# Altium schematic sheet 23_SFP_PORTS.SchDoc
size 419 x 296 mm; Author: Serbinov O.A.; CompanyName: ELSICOM; DrawnBy: Serbinov O.A.; Engineer: Serbinov O.A.; Organization: Elsicom; Address1: Kirova avenue, 58; Address2: Tomsk; Address3: Russia 634012; DocumentNumber: 24; SheetNumber: 24; SheetTotal: 44; ProjectName: 48_PORTS
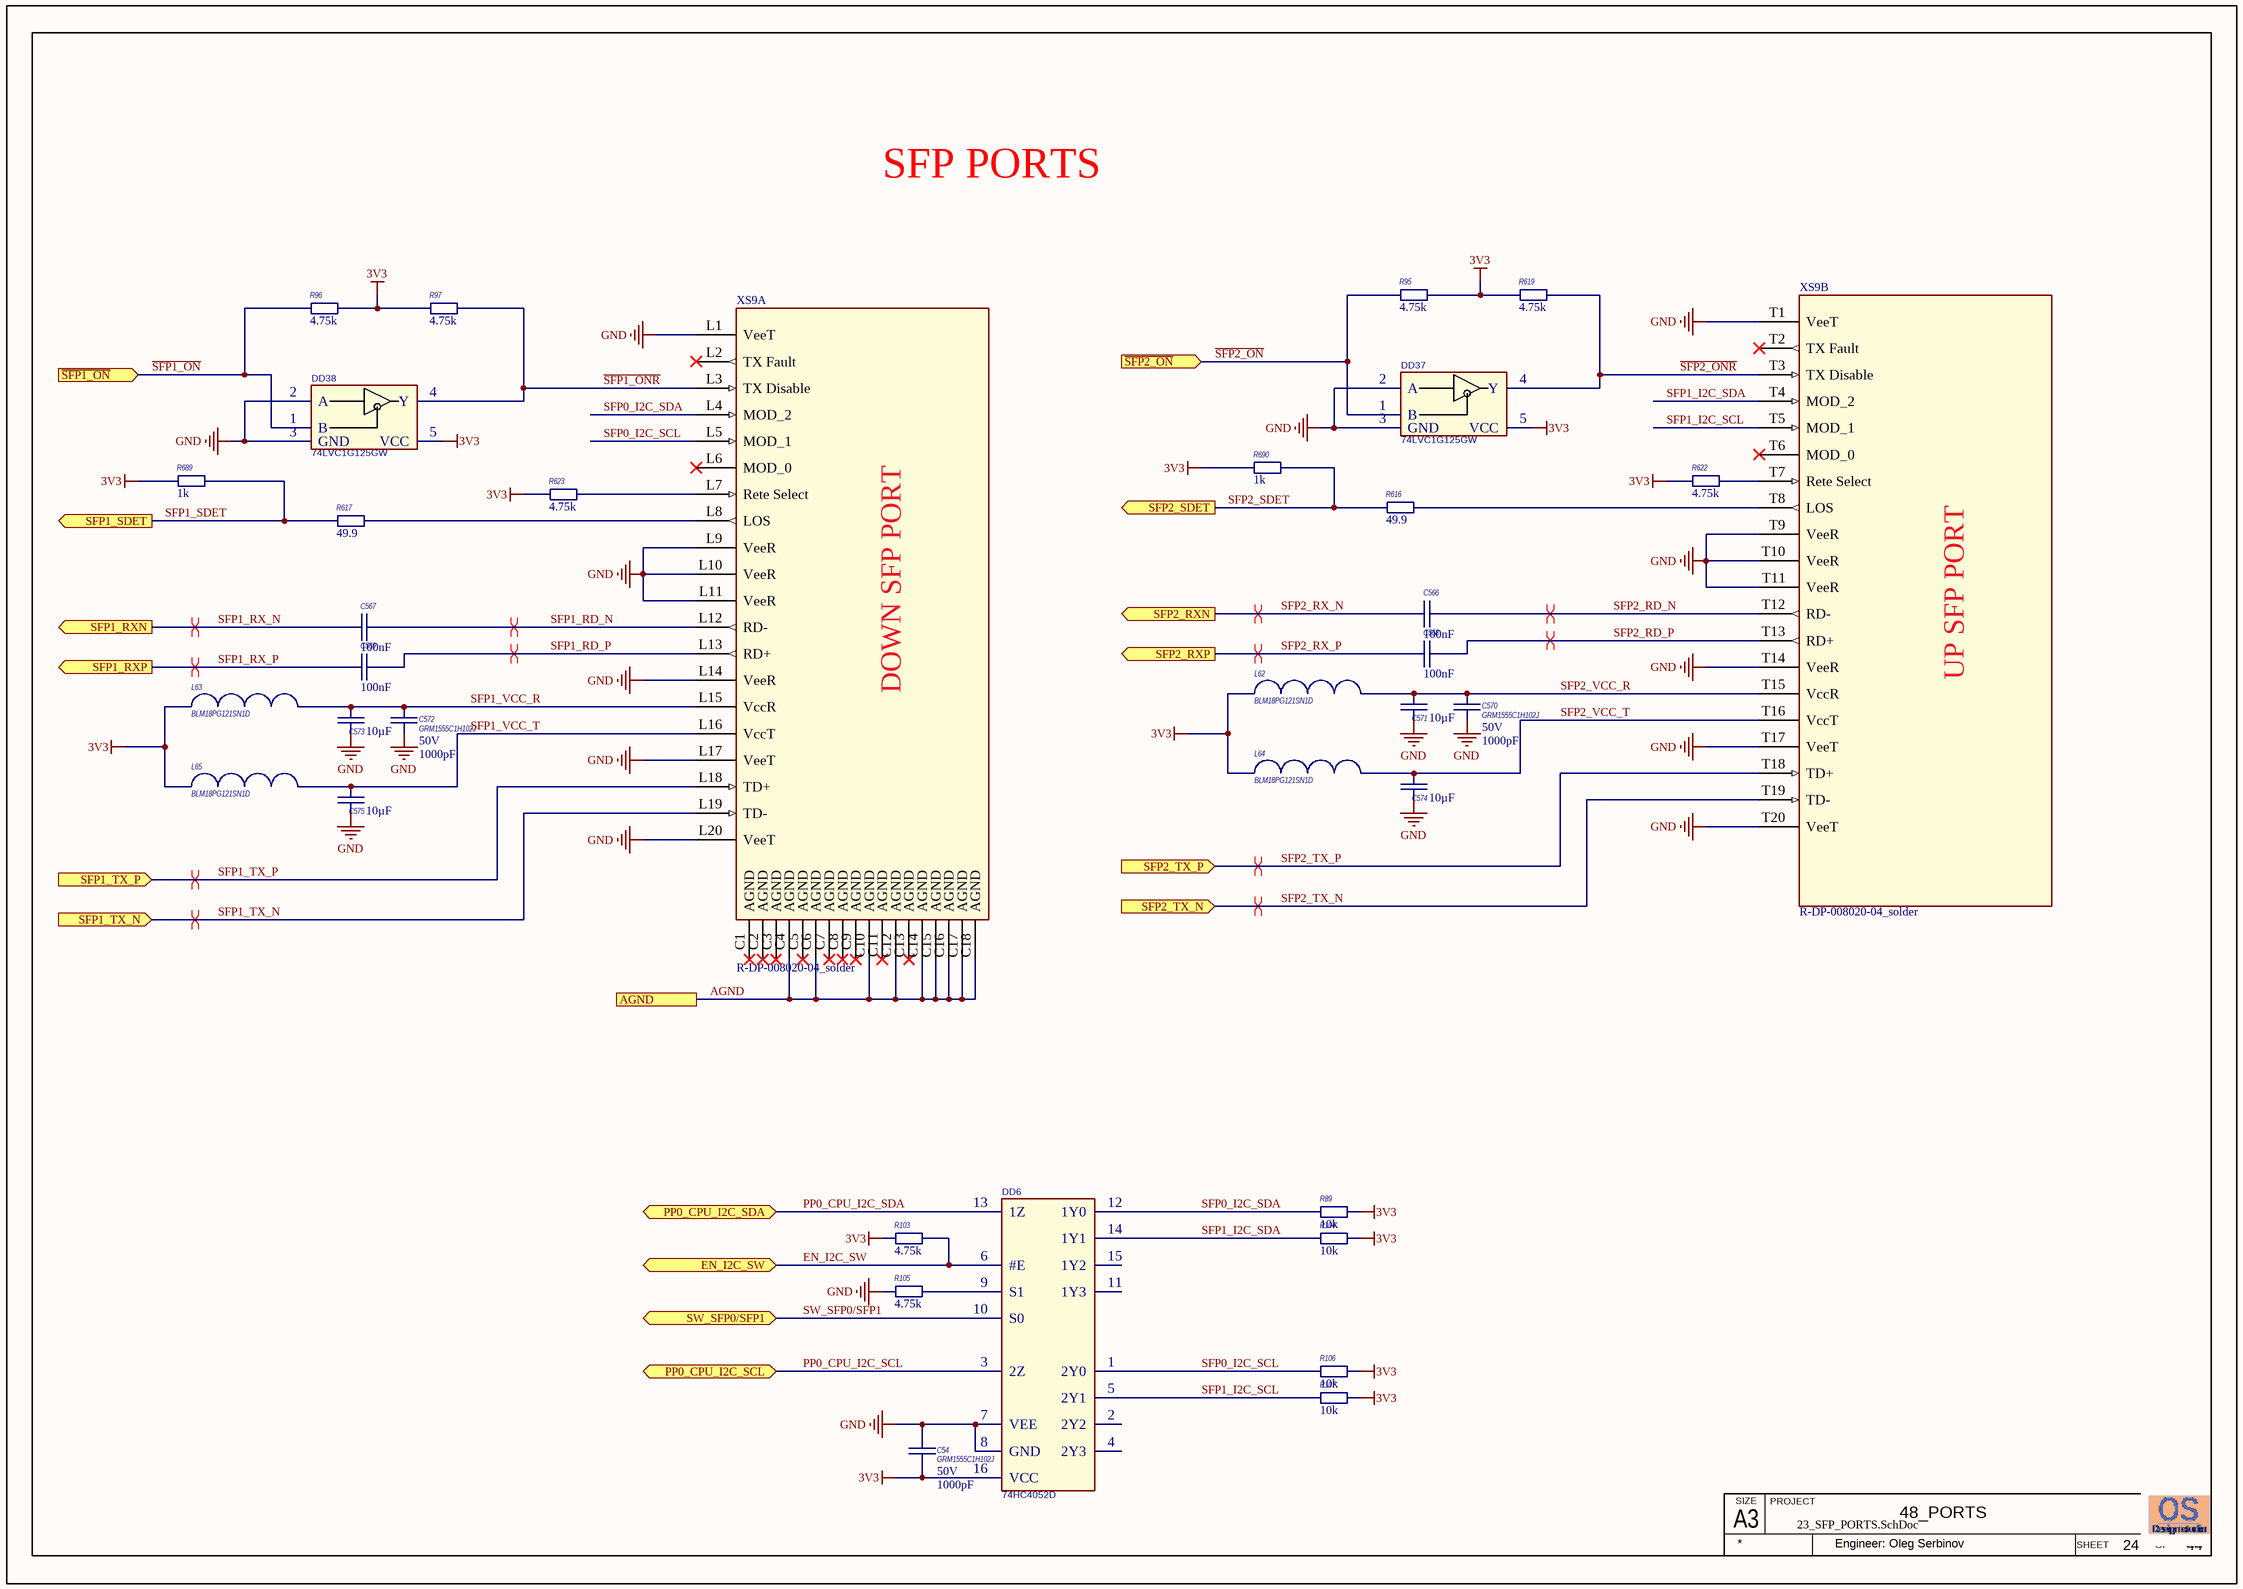
[diagram p0: 23_SFP_PORTS.SchDoc]

## Parts
C54  GRM1555C1H102J  Voltage - Rated: 50V  Capacitance: 1000pF  [CAPC1005[0402]]
C566  Capacitance: 100nF  [C0402_IPC High Density]  (hidden comment: GRM155R71E104KE14D)
C567  Capacitance: 100nF  [C0402_IPC High Density]  (hidden comment: GRM155R71E104KE14D)
C568  Capacitance: 100nF  [C0402_IPC High Density]  (hidden comment: GRM155R71E104KE14D)
C569  Capacitance: 100nF  [C0402_IPC High Density]  (hidden comment: GRM155R71E104KE14D)
C570  GRM1555C1H102J  Voltage - Rated: 50V  Capacitance: 1000pF  [CAPC1005[0402]]
C571  Capacitance: 10µF  [CAPC2012[0805]]  (hidden comment: GRM21BR61C106KE15)
C572  GRM1555C1H102J  Voltage - Rated: 50V  Capacitance: 1000pF  [CAPC1005[0402]]
C573  Capacitance: 10µF  [CAPC2012[0805]]  (hidden comment: GRM21BR61C106KE15)
C574  Capacitance: 10µF  [CAPC2012[0805]]  (hidden comment: GRM21BR61C106KE15)
C575  Capacitance: 10µF  [CAPC2012[0805]]  (hidden comment: GRM21BR61C106KE15)
DD6  74HC4052D  [SOIC-16]
DD37  74LVC1G125GW  [TSSOP5 (SOT353)]
DD38  74LVC1G125GW  [TSSOP5 (SOT353)]
L62  BLM18PG121SN1D  [INDC1608X95N]
L63  BLM18PG121SN1D  [INDC1608X95N]
L64  BLM18PG121SN1D  [INDC1608X95N]
L65  BLM18PG121SN1D  [INDC1608X95N]
R89  Resistance: 10k  [R0402_IPC High Density]  (hidden comment: ERJ-2RKF1002X)
R95  Resistance (Ohms): 4.75k  [R0402_IPC High Density]  (hidden comment: ERJ-2RKF4751X)
R96  Resistance (Ohms): 4.75k  [R0402_IPC High Density]  (hidden comment: ERJ-2RKF4751X)
R97  Resistance (Ohms): 4.75k  [R0402_IPC High Density]  (hidden comment: ERJ-2RKF4751X)
R103  Resistance (Ohms): 4.75k  [R0402_IPC High Density]  (hidden comment: ERJ-2RKF4751X)
R104  Resistance: 10k  [R0402_IPC High Density]  (hidden comment: ERJ-2RKF1002X)
R105  Resistance (Ohms): 4.75k  [R0402_IPC High Density]  (hidden comment: ERJ-2RKF4751X)
R106  Resistance: 10k  [R0402_IPC High Density]  (hidden comment: ERJ-2RKF1002X)
R107  Resistance: 10k  [R0402_IPC High Density]  (hidden comment: ERJ-2RKF1002X)
R616  Resistance: 49.9  [R0402_IPC High Density]  (hidden comment: ERJ-2RKF49R9X)
R617  Resistance: 49.9  [R0402_IPC High Density]  (hidden comment: ERJ-2RKF49R9X)
R619  Resistance (Ohms): 4.75k  [R0402_IPC High Density]  (hidden comment: ERJ-2RKF4751X)
R622  Resistance (Ohms): 4.75k  [R0402_IPC High Density]  (hidden comment: ERJ-2RKF4751X)
R623  Resistance (Ohms): 4.75k  [R0402_IPC High Density]  (hidden comment: ERJ-2RKF4751X)
R689  Resistance: 1k  [R0402_IPC High Density]  (hidden comment: ERJ-2RKF1001X)
R690  Resistance: 1k  [R0402_IPC High Density]  (hidden comment: ERJ-2RKF1001X)
XS9  R-DP-008020-04_solder  [R-DP-008020-04_solder]  (parts A,B of 2)

## Ports
AGND, EN_I2C_SW (bidir), PP0_CPU_I2C_SCL (bidir), PP0_CPU_I2C_SDA (bidir), SFP1_RXN (out), SFP1_RXP (out), SFP1_SDET (out), SFP1_TX_N (in), SFP1_TX_P (in), SFP2_RXN (out), SFP2_RXP (out), SFP2_SDET (out), SFP2_TX_N (in), SFP2_TX_P (in), SW_SFP0/SFP1 (bidir), ~{SFP1_ON} (in), ~{SFP2_ON} (in)

## Nets
3V3: C54.2 DD6.16(VCC) DD37.5(VCC) DD38.5(VCC) L62.1 L63.1 L64.1 L65.1 R89.1 R95.2 R96.2 R97.1 R103.1 R104.1 R106.1 R107.1 R619.1 R622.1 R623.1 R689.1 R690.1
GND: C54.1 C570.1 C571.1 C572.1 C573.1 C574.2 C575.2 DD6.7(VEE) DD6.8(GND) DD37.2(A) DD37.3(GND) DD38.2(A) DD38.3(GND) R105.1 XS9.L1(VeeT) XS9.L9(VeeR) XS9.L10(VeeR) XS9.L11(VeeR) XS9.L14(VeeR) XS9.L17(VeeT) XS9.L20(VeeT) XS9.T1(VeeT) XS9.T9(VeeR) XS9.T10(VeeR) XS9.T11(VeeR) XS9.T14(VeeR) XS9.T17(VeeT) XS9.T20(VeeT)
~{SFP1_ON}: DD38.1(B) R96.1 ; port ~{SFP1_ON}
~{SFP1_ONR}: DD38.4(Y) R97.2 XS9.L3(TX_Disable)
~{SFP2_ON}: DD37.1(B) R95.1 ; port ~{SFP2_ON}
~{SFP2_ONR}: DD37.4(Y) R619.2 XS9.T3(TX_Disable)
AGND: XS9.C4(AGND) XS9.C6(AGND) XS9.C10(AGND) XS9.C12(AGND) XS9.C14(AGND) XS9.C15(AGND) XS9.C16(AGND) XS9.C17(AGND) XS9.C18(AGND) ; port AGND
EN_I2C_SW: DD6.6(#E) R103.2 ; port EN_I2C_SW
PP0_CPU_I2C_SCL: DD6.3(2Z) ; port PP0_CPU_I2C_SCL
PP0_CPU_I2C_SDA: DD6.13(1Z) ; port PP0_CPU_I2C_SDA
SFP0_I2C_SCL: DD6.1(2Y0) R106.2 XS9.L5(MOD_1)
SFP0_I2C_SDA: DD6.12(1Y0) R89.2 XS9.L4(MOD_2)
SFP1_I2C_SCL: DD6.5(2Y1) R107.2 XS9.T5(MOD_1)
SFP1_I2C_SDA: DD6.14(1Y1) R104.2 XS9.T4(MOD_2)
SFP1_RD_N: C567.1 XS9.L12(RD-)
SFP1_RD_P: C569.1 XS9.L13(RD+)
SFP1_RX_N: C567.2 ; port SFP1_RXN
SFP1_RX_P: C569.2 ; port SFP1_RXP
SFP1_SDET: R617.1 R689.2 ; port SFP1_SDET
SFP1_TX_N: XS9.L19(TD-) ; port SFP1_TX_N
SFP1_TX_P: XS9.L18(TD+) ; port SFP1_TX_P
SFP1_VCC_R: C572.2 C573.2 L63.2 XS9.L15(VccR)
SFP1_VCC_T: C575.1 L65.2 XS9.L16(VccT)
SFP2_RD_N: C566.1 XS9.T12(RD-)
SFP2_RD_P: C568.1 XS9.T13(RD+)
SFP2_RX_N: C566.2 ; port SFP2_RXN
SFP2_RX_P: C568.2 ; port SFP2_RXP
SFP2_SDET: R616.1 R690.2 ; port SFP2_SDET
SFP2_TX_N: XS9.T19(TD-) ; port SFP2_TX_N
SFP2_TX_P: XS9.T18(TD+) ; port SFP2_TX_P
SFP2_VCC_R: C570.2 C571.2 L62.2 XS9.T15(VccR)
SFP2_VCC_T: C574.1 L64.2 XS9.T16(VccT)
SW_SFP0/SFP1: DD6.10(S0) ; port SW_SFP0/SFP1
NetDD6_9: DD6.9(S1) R105.2
NetR616_2: R616.2 XS9.T8(LOS)
NetR617_2: R617.2 XS9.L8(LOS)
NetR622_2: R622.2 XS9.T7(Rete_Select)
NetR623_2: R623.2 XS9.L7(Rete_Select)

Not connected (* = marked no-connect by the designer): DD6 2(2Y2) 4(2Y3) 11(1Y3) 15(1Y2); XS9 C1(AGND)* C2(AGND)* C3(AGND)* C5(AGND)* C7(AGND)* C8(AGND)* C9(AGND)* C11(AGND)* C13(AGND)* L2(TX_Fault)* L6(MOD_0)* T2(TX_Fault)* T6(MOD_0)*

## Layout directives
differential pair: SFP1_RD_N, SFP1_RD_P, SFP1_RX_N, SFP1_RX_P, SFP1_TX_N, SFP1_TX_P, SFP2_RD_N, SFP2_RD_P, SFP2_RX_N, SFP2_RX_P, SFP2_TX_N, SFP2_TX_P

## Notes on the sheet
- SFP PORTS
- A3
- SIZE
- PROJECT
- SHEET
- OF
- Engineer: Oleg Serbinov
- (in symbol R-DP-008020-04_solder, part A) DOWN SFP PORT
- (in symbol R-DP-008020-04_solder, part B) UP SFP PORT

## Library data of the parts
C54 C570 C572 = GRM1555C1H102J: C0402, 1nF 5%, 50V, C0G; Manufacturer: Murata; Customer Part Number: Конденсатор, 1n, 0402, 50V, C0G, 5%; Temperature Coefficient: C0G, NP0; Analogs: any suitable; Packaging: Cut Tape (CT); Ratings: -; Manufacturer Part Number: GRM1555C1H102J; Tolerance: ±5%; Operating Temperature: -55°C ~ 125°C; Lead Spacing: -; Features: -; Mounting Type: Surface Mount, MLCC; Lead Style: -; Size / Dimension: 0.039" L x 0.020" W (1.00mm x 0.50mm); Height - Seated (Max): -; Thickness (Max): 0.022" (0.55mm); RoHS: RoHS Compliant; Package / Case: 0402 (1005 Metric); Applications: General Purpose; Supplier: Digi-Key; Category: Capacitors; Supplier Part Number: 490-3244-1-ND; ComponentLink1URL: http://search.murata.co.jp/Ceramy/image/img/PDF/ENG/GRM1555C1H102JA01.pdf; ComponentLink1Description: http://search.murata.co.jp/Ceramy/image/img/PDF/ENG/GRM1555C1H102JA01.pdf; Pricing: 1=0.11, 10=0.077, 50=0.0416, 100=0.0352, 250=0.0288, 500=0.02464, 1000=0.0192, 5000=0.016 (USD)
C566-C569 = GRM155R71E104KE14D: C0402, 100nF, 25V, X7R; Manufacturer: Murata; Rmanufacturer: Yageo  Samsung  TDK  Taiyo Yuden  Kemet; Customer Part Number: Конденсатор, 100n, 0402, 25V, X7R, 10%; Capacitance Tolerance: ± 10%; Voltage Rating: 16; Capacitor Case Style: 0402 [1005 Metric]; Capacitor Terminals: SMD; SVHC: No SVHC (19-Dec-2012); No. of Pins: 2; Reel Quantity: 10000; Tolerance +: 10%; Analogs: any suitable; Manufacturer Part Number: GRM155R71E104KE14D; RoHS: YES; Packaging: Reel; Package / Case: 0402; ComponentLink1URL: http://www.farnell.com/datasheets/4360.pdf; ComponentLink1Description: http://www.farnell.com/datasheets/4360.pdf; Pricing: 10000=0.008593, 30000=0.007991 (GBP); Supplier 1: Farnell; Supplier Part Number 1: 1118151; Stock: 3; Dielectric Characteristic: X7R; Operating Temperature Min: -55; Operating Temperature Max: 125; Operating Temperature Range: -55°C to +125; Series: GRM Hi-Cap; Terminal Type: Surface Mount (SMD, SMT); Tolerance -: 10%; Voltage Rating V DC: 16
C571 C573-C575 = GRM21BR61C106KE15: C0805, 10uF 10%, 16V, X5R; Manufacturer: Murata; Customer Part Number: Конденсатор, 10u, 0805, 16V, X5R, 10%; Analogs: any suitable; Applications: General Purpose; Category: Capacitors; Operating Temperature: -55°C ~ 85°C; Package / Case: 0805 (2012 Metric); Size / Dimension: 0.079" L x 0.049" W (2.00mm x 1.25mm); Temperature Coefficient: X5R; Tolerance: ±10%; ComponentLink1URL: http://search.murata.co.jp/Ceramy/image/img/PDF/ENG/GRM21BR61C106KE15.pdf; ComponentLink1Description: http://search.murata.co.jp/Ceramy/image/img/PDF/ENG/GRM21BR61C106KE15.pdf; Pricing: 1=0.3, 10=0.25, 50=0.1408, 100=0.1252, 250=0.09392, 500=0.08294, 1000=0.07356 (USD); Voltage - Rated: 16V; Manufacturer Part Number: GRM21BR61C106KE15
DD6 = 74HC4052D: IC MUX/DEMUX DUAL 4X1, 16SOIC; Customer Part Number: Микросхема, 74HC4052D, IC MUX/DEMUX DUAL 4X1, 16-SOIC; Manufacturer: NXP Semiconductors; Manufacturer Part Number: 74HC4052D
DD37 DD38 = 74LVC1G125GW: IC Bus buffer/line driver 3-state, TSSOP5; Manufacturer: NXP Semiconductors; Customer Part Number: Микросхема, 74LVC1G125GW, IC BUFF DVR TRI-ST N-INV, 5-TSSOP; Description 1: NXP - 74LVC1G125GW - IC, LOGIC, 74LVC1G, BUFFER, UMT5; Logic Device Type: Buffer / Line Driver, Non Inverting; Supply Voltage Range: 1.65V to 5.5; Logic Case Style: SOT-353; No. of Pins: 5; SVHC: No SVHC (18-Jun-2012); Logic Function Number: 741G125; Logic IC Base Number: 741125; Logic IC Family: LVC; Supply Voltage Max: 5.5; Supply Voltage Min: 1.65; Analogs: 74LVC1G125SE-7, SN74LVC1G125DCKT, NL17SZ125DFT2G,; Supplier 1: Farnell; Supplier Part Number 1: 1631685; RoHS 1: YES; Stock 1: 3266; Pricing 1: 1=0.134, 10=0.083, 100=0.068 (GBP); Operating Temperature Range: -40°C to +125; Logic IC Function: Bus Buffer / Line Driver 3; Package / Case: SOT-353; Termination Type: SMD; ComponentLink1URL: http://www.farnell.com/datasheets/1245559.pdf; ComponentLink1Description: http://www.farnell.com/datasheets/1245559.pdf; ComponentLink2URL: http://www.farnell.com/cad/1549315.zip; ComponentLink2Description: http://www.farnell.com/cad/1549315.zip; Supplier: Farnell; RoHS: YES; Manufacturer Part Number: 74LVC1G125GW; Supplier Part Number: 1631685; Pricing: 1=0.134, 10=0.083, 100=0.068 (GBP)
L62-L65 = BLM18PG121SN1D: FILTER BLM18 (0603, 2A); Manufacturer: Murata; Rpart number: MPZ1608S121ATAH0 ; CIC10P121NC ; MPZ1608S121ATDH5 ; BLM18PG121SH1D ; 742792625; Rmanufacturer: Boruns  Samsung  TDK  Murata  Wurth Electronics; Customer Part Number: Дроссель, BLM18PG121SN1D, FERRITE BEAD 120 OHM 1LN, 0603; DC Resistance Max: 0.05; Impedance: 120; Ferrite Mounting: SMD; Inductor Type: Ferrite Bead; SVHC: No SVHC (19-Dec-2011); Ferrite Case Style: 0603 / 1608; Core Material: Ferrite; DC Current Max: 2000; Inductor Case Style: 0603; Inductance Tolerance: ± 25%; No. of Pins: 2; RoHS: YES; Operating Temperature Min: -55; Mounting Type: SMD; Operating Temperature Max: +125; Package / Case: 0603; Impedance @ 100MHz Typ: 120; Resistance: 0.05; Supplier Part Number: 1515738; Supplier: Farnell; ComponentLink1URL: http://www.farnell.com/datasheets/5148.pdf; ComponentLink1Description: http://www.farnell.com/datasheets/5148.pdf; Pricing: 5=0.056, 50=0.041, 100=0.034, 250=0.028, 500=0.027 (GBP); Manufacturer Part Number: BLM18PG121SN1D; DC Current Rating: 2A; Analogs: MPZ1608S121ATAH0 ; CIC10P121NC ; MPZ1608S121ATDH5 ; BLM18PG121SH1D ; 742792625
R89 R104 R106 R107 = ERJ-2RKF1002X: R0402, 10k 1%; Manufacturer: Panasonic; Rpart number: RC0402FR-0710KL ; RC1005F103CS ; RMCF0402FT10K0 ; MCR01MZPF1002 ; MCR01MRTF1002; Rmanufacturer: Yageo  Samsung  Stackpole Electronics  Rohm Semiconductor  Vishay Dale; Customer Part Number: Резистор, 10K, 0402, 1%; Power Rating: 100 mWatts; Voltage Rating: 50 Volts; Temperature Coefficient: 100 PPM / C; Analogs: any suitable; Minimum Order Quantity: 1; Supplier Part Number: 667-ERJ-2RKF1002X; Packaging: Reel; Product: Thick Film Resistors SMD; Package / Case: 0402 (1005 metric); Category: Thick Film Resistors - SMD; Supplier: Mouser; Manufacturer Part Number: ERJ-2RKF1002X; RoHS: RoHS Compliant By Exemption; Operating Temperature Range: - 55 C to + 155 C; Dimensions: 0.5 mm W x 1 mm L x 0.35 mm H; Reeling: True; Series: ERJ; Product Category: .; Standard Pack Qty: 10000; Termination Style: SMD/SMT; Tolerance: 1 %; RoHS - Mouser: E; ComponentLink1URL: http://industrial.panasonic.com/www-data/pdf/AOA0000/AOA0000CE2.pdf; ComponentLink1Description: http://industrial.panasonic.com/www-data/pdf/AOA0000/AOA0000CE2.pdf; Pricing: 1=0.135, 25=0.032, 100=0.024, 250=0.018, 500=0.014, 1000=0.008, 2000=0.007, 5000=0.004 (AUD)
R95-R97 R103 R105 R619 R622 R623 = ERJ-2RKF4751X: R0402, 4.75k 1%; Manufacturer: Panasonic; Rpart number: RC0402FR-074K75L ; RC1005F4751CS ; RMCF0402FT4K75 ; CRCW04024K75FKED ; TRR01MZPF4751; Rmanufacturer: Yageo  Samsung  Stackpole Electronics  Rohm Semiconductor  Vishay Dale; Customer Part Number: Резистор, 4K75, 0402, 1%; Temperature Coefficient: ±100ppm/°C; Power (Watts): 0.1W, 1/10W; Analogs: any suitable; Tolerance: ±1%; Packaging: Cut Tape (CT); Package / Case: 0402 (1005 Metric); Category: Resistors; Manufacturer Part Number: ERJ-2RKF4751X; Supplier Part Number: P4.75KLCT-ND; RoHS: RoHS Compliant; Supplier: Digi-Key; ComponentLink1URL: http://industrial.panasonic.com/www-cgi/jvcr13pz.cgi?E+PZ+3+AOA0002+ERJ2RKF4751X+7+WW; ComponentLink1Description: http://industrial.panasonic.com/www-cgi/jvcr13pz.cgi?E+PZ+3+AOA0002+ERJ2RKF4751X+7+WW; Features: -; Composition: Thick Film; Height: 0.016" (0.40mm); Number of Terminations: 2; Supplier Device Package: 0402; Size / Dimension: 0.039" L x 0.020" W (1.00mm x 0.50mm)
R616 R617 = ERJ-2RKF49R9X: R0402, 49.9R 1%; Manufacturer: Panasonic; Rpart number: RC0402FR-0749R9L ; RC1005F49R9CS ; MCR01MRTF49R9 ; CRCW040249R9FKED ; CR0402-FX-49R9GLF; Rmanufacturer: Yageo  Samsung  Stackpole Electronics  Rohm Semiconductor  Vishay Dale; Customer Part Number: Резистор, 49R9, 0402, 1%; Temperature Coefficient: 100 PPM / C; Voltage Rating: 50 Volts; Power Rating: 100 mWatts; Analogs: any suitable; Category: Thick Film Resistors - SMD; Supplier: Mouser; Supplier Part Number: 667-ERJ-2RKF49R9X; Manufacturer Part Number: ERJ-2RKF49R9X; Product Category: .; Minimum Order Quantity: 1; Series: ERJ; Product: Thick Film Resistors SMD; RoHS - Mouser: E; Reeling: True; Packaging: Reel; Termination Style: SMD/SMT; Package / Case: 0402 (1005 metric); Standard Pack Qty: 10000; Tolerance: 1 %; Operating Temperature Range: - 55 C to + 155 C; RoHS: RoHS Compliant By Exemption; Dimensions: 0.5 mm W x 1 mm L x 0.35 mm H; ComponentLink1URL: http://industrial.panasonic.com/www-data/pdf/AOA0000/AOA0000CE2.pdf; ComponentLink1Description: http://industrial.panasonic.com/www-data/pdf/AOA0000/AOA0000CE2.pdf; Pricing: 1=0.135, 25=0.032, 100=0.024, 250=0.018, 500=0.014, 1000=0.008, 2000=0.007, 5000=0.004 (AUD)
R689 R690 = ERJ-2RKF1001X: R0402, 1k 1%; Manufacturer: Panasonic; Rpart number: RC0402FR-071KL ; RC1005F102CS ; RMCF0402FT1K00 ; MCR01MRTF1001 ; CRCW04021K00FKED ; ERJ2RKF1001X; Rmanufacturer: Yageo  Samsung  Stackpole Electronics  Rohm Semiconductor  Vishay Dale; Customer Part Number: Резистор, 1K, 0402, 1%; Temperature Coefficient: 100 PPM / C; Power Rating: 100 mWatts; Voltage Rating: 50 Volts; Analogs: any suitable; Supplier: Mouser; Termination Style: SMD/SMT; Series: ERJ; Supplier Part Number: 667-ERJ-2RKF1001X; RoHS: RoHS Compliant By Exemption; Dimensions: 0.5 mm W x 1 mm L x 0.35 mm H; Package / Case: 0402 (1005 metric); Product Category: .; Manufacturer Part Number: ERJ-2RKF1001X; Packaging: Reel; Tolerance: 1 %; Operating Temperature Range: - 55 C to + 155 C; Category: Thick Film Resistors - SMD; Product: Thick Film Resistors SMD; Reeling: True; Minimum Order Quantity: 1; RoHS - Mouser: E; Standard Pack Qty: 10000; ComponentLink1URL: http://industrial.panasonic.com/www-data/pdf/AOA0000/AOA0000CE2.pdf; ComponentLink1Description: http://industrial.panasonic.com/www-data/pdf/AOA0000/AOA0000CE2.pdf; Pricing: 1=0.135, 25=0.032, 100=0.024, 250=0.018, 500=0.014, 1000=0.008, 2000=0.007, 5000=0.004 (AUD)
XS9 = R-DP-008020-04_solder: Connector SFP CAGE 2X1 PRESS FIT; Customer Part Number: Разъем, R-DP-008020-04, SFP 2X1 Stacked Cage, PRESS FIT; Manufacturer: ALL BEST; Analogs: 80480KB-0C4-10L; Manufacturer Part Number: R-DP-008020-04